# EAGLE design trackduino nano (EAGLE 7.1.0)
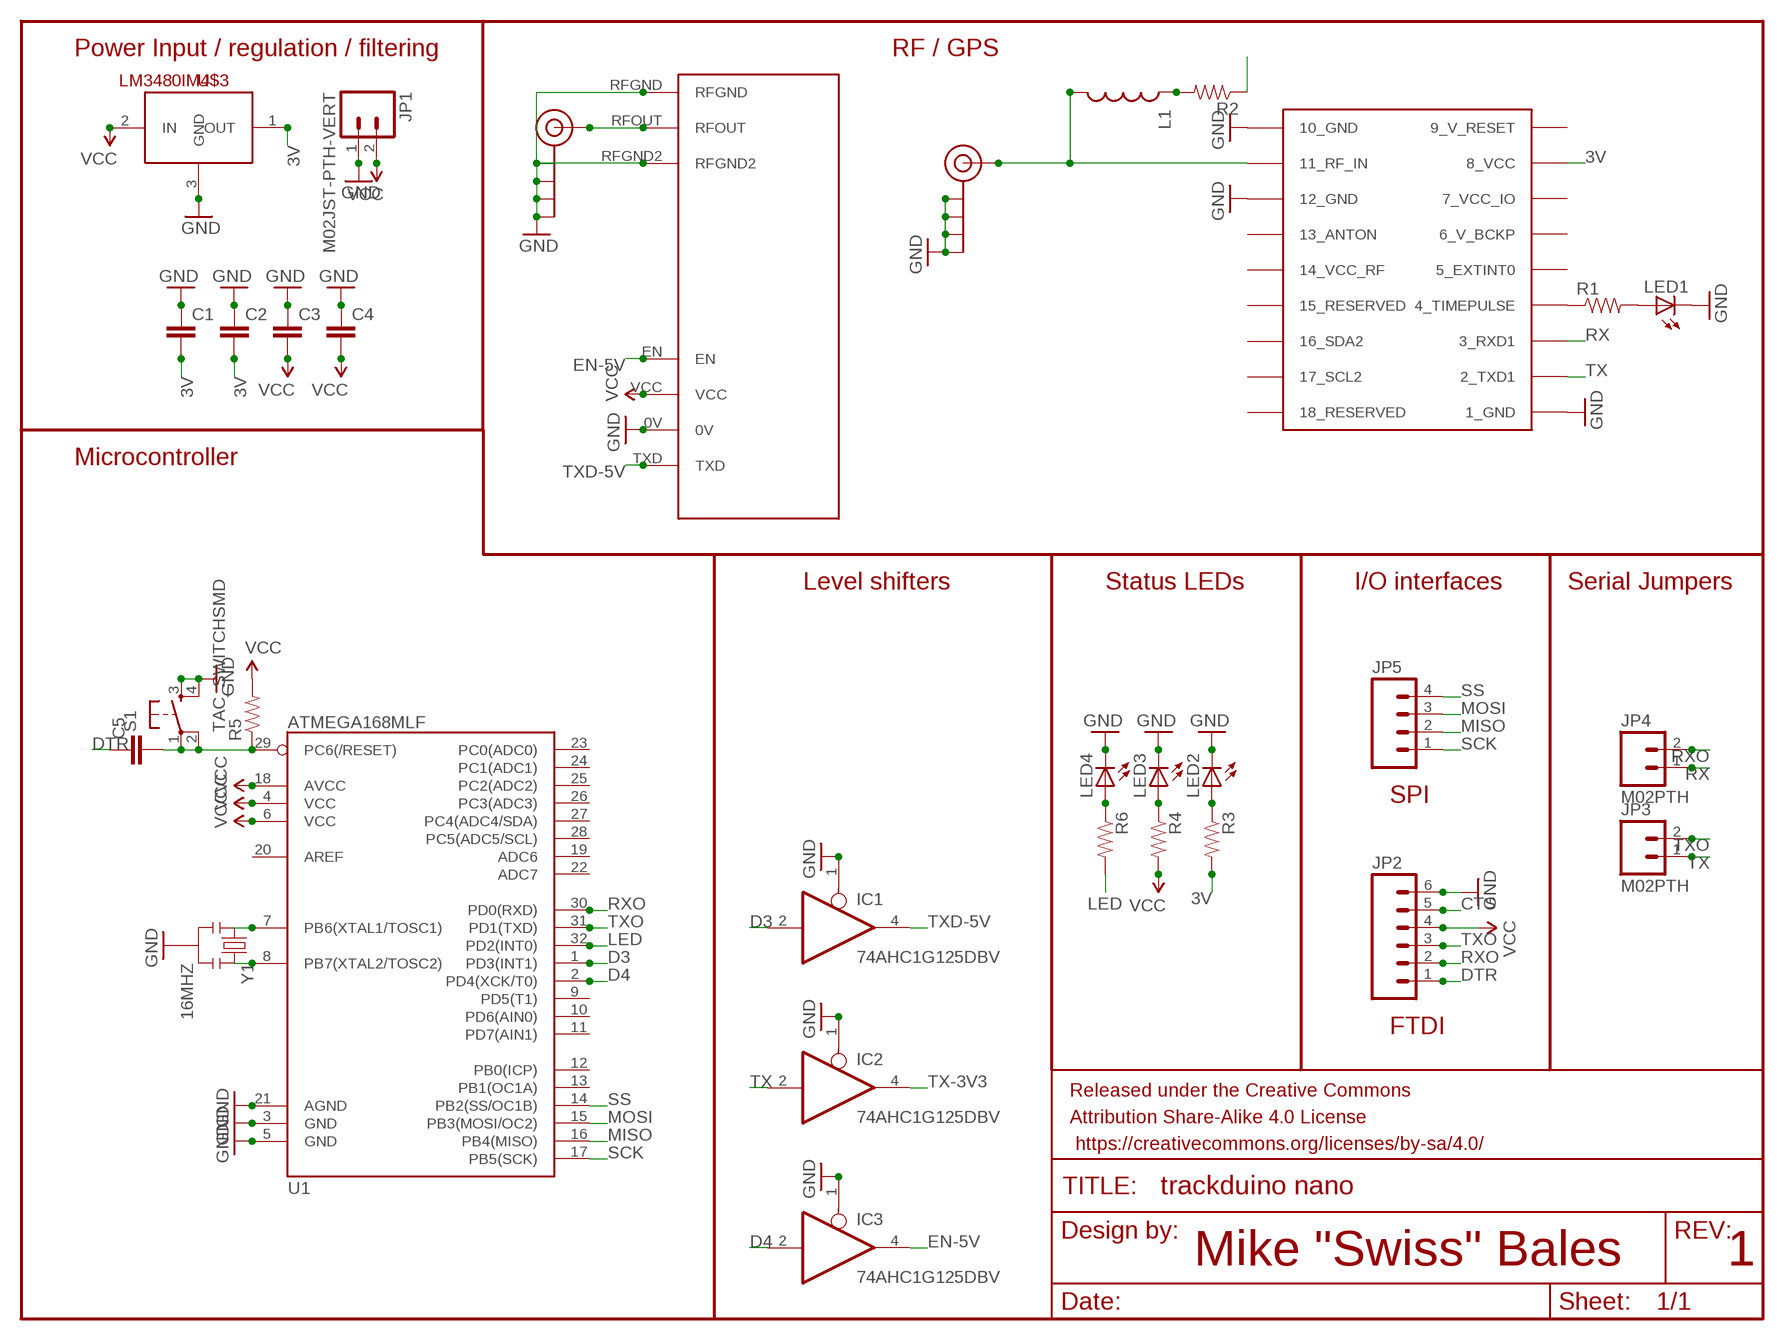
[diagram p0: schematic, sheet 1]

## Parts
C1  CAP0805  [0805]
C2  CAP0805  [0805]
C3  CAP0805  [0805]
C4  CAP0805  [0805]
C5  CAP0805  [0805]
FRAME1  FRAME-LETTER  [CREATIVE_COMMONS]
IC1  74AHC1G125DBV  [SOT23-5]
IC2  74AHC1G125DBV  [SOT23-5]
IC3  74AHC1G125DBV  [SOT23-5]
J$1  SMA_EDGE  [SMA-EDGE]
J$2  SMA_EDGE  [SMA-EDGE]
JP1  M02JST-PTH-VERT  [JST-2-PTH-VERT]
JP2  M06NO_SILK_FEMALE_PTH  [1X06_NO_SILK]
JP3  M02PTH  [1X02]
JP4  M02PTH  [1X02]
JP5  M041X04_NO_SILK  [1X04_NO_SILK]
L1  INDUCTOR0805  [0805]
LED1  LEDCHIP-LED0805  [CHIP-LED0805]
LED2  LEDCHIP-LED0805  [CHIP-LED0805]
LED3  LEDCHIP-LED0805  [CHIP-LED0805]
LED4  LEDCHIP-LED0805  [CHIP-LED0805]
R1  RESISTOR0805-RES  [0805]
R2  RESISTOR0805-RES  [0805]
R3  RESISTOR0805-RES  [0805]
R4  RESISTOR0805-RES  [0805]
R5  RESISTOR0805-RES  [0805]
R6  RESISTOR0805-RES  [0805]
S1  TAC_SWITCHSMD  [TACTILE-SWITCH-SMD]
U1  ATMEGA168MLF  [MLF32]
U$1  UBLOX_MAX  [UBLOX_MAX]
U$2  RADIOMETRIX-HX1  [RADIOMETRIX-HX1]
U$3  LM3480IM4  [SOT23-3]
Y1  16MHZ  RESONATOR16MHZ  [RESONATOR-SMD]

## Nets
3V: C1.2 C2.2 R3.2 U$1.8_VCC U$3.1(OUT)
CTS: JP2.5
D3: IC1.2(I) U1.1(PD3(INT1))
D4: IC3.2(I) U1.2(PD4(XCK/T0))
DTR: C5.1 JP2.1
EN-5V: IC3.4(O) U$2.EN
GND: C1.1 C2.1 C3.1 C4.1 IC1.1(OE) IC2.1(OE) IC3.1(OE) J$1.GND@0(GND) J$1.GND@1(GND) J$1.GND@2(GND) J$1.GND@3(GND) J$2.GND@0(GND) J$2.GND@1(GND) J$2.GND@2(GND) J$2.GND@3(GND) JP1.1 JP2.6 LED1.C LED2.C LED3.C LED4.C S1.3 S1.4 U1.3(GND) U1.5(GND) U1.21(AGND) U$1.1_GND U$1.10_GND U$1.12_GND U$2.0V U$2.RFGND U$2.RFGND2 U$3.3(GND) Y1.2
LED: R6.2 U1.32(PD2(INT0))
MISO: JP5.2 U1.16(PB4(MISO))
MOSI: JP5.3 U1.15(PB3(MOSI/OC2))
N$1: J$1.SIG(SIGNAL) U$2.RFOUT
N$2: R1.1 U$1.4_TIMEPULSE
N$3: LED1.A R1.2
N$4: R2.1
N$5: L1.1 R2.2
N$6: J$2.SIG(SIGNAL) L1.2 U$1.11_RF_IN
N$7: LED2.A R3.1
N$8: LED3.A R4.1
N$9: C5.2 R5.1 S1.1 S1.2 U1.29(PC6(/RESET))
N$14: U1.8(PB7(XTAL2/TOSC2)) Y1.3
N$26: U1.7(PB6(XTAL1/TOSC1)) Y1.1
N$27: LED4.A R6.1
RX: JP4.1 U$1.3_RXD1
RXO: JP2.2 JP4.2 U1.30(PD0(RXD))
SCK: JP5.1 U1.17(PB5(SCK))
SS: JP5.4 U1.14(PB2(SS/OC1B))
TX: IC2.2(I) JP3.1 U$1.2_TXD1
TX-3V3: IC2.4(O)
TXD-5V: IC1.4(O) U$2.TXD
TXO: JP2.3 JP3.2 U1.31(PD1(TXD))
VCC: C3.2 C4.2 JP1.2 JP2.4 R4.2 R5.2 U1.4(VCC) U1.6(VCC) U1.18(AVCC) U$2.VCC U$3.2(IN)
Unconnected: U1.9(PD5(T1)) U1.10(PD6(AIN0)) U1.11(PD7(AIN1)) U1.12(PB0(ICP)) U1.13(PB1(OC1A)) U1.19(ADC6) U1.20(AREF) U1.22(ADC7) U1.23(PC0(ADC0)) U1.24(PC1(ADC1)) U1.25(PC2(ADC2)) U1.26(PC3(ADC3)) U1.27(PC4(ADC4/SDA)) U1.28(PC5(ADC5/SCL)) U$1.5_EXTINT0 U$1.6_V_BCKP U$1.13_ANTON U$1.14_VCC_RF U$1.15_RESERVED U$1.16_SDA2 U$1.17_SCL2 U$1.18_RESERVED

## Notes on the sheet
- Power Input / regulation / filtering | RF / GPS
- Microcontroller
- Level shifters | Status LEDs | I/O interfaces | Serial Jumpers
- SPI
- FTDI
- Mike "Swiss" Bales | 1

## Power pins joined to a net without a drawn wire
7_VCC_IO: U$1.7_VCC_IO
9_V_RESET: U$1.9_V_RESET
GND: IC1.3(GND) IC2.3(GND) IC3.3(GND)
VCC: IC1.5(VCC) IC2.5(VCC) IC3.5(VCC)

## Library data of the parts
C1-C5 = SparkFun-Capacitors:CAP: Capacitor Standard 0603 ceramic capacitor, and 0.1" leaded capacitor.
FRAME1 = SparkFun-Aesthetics:FRAME-LETTER: Schematic Frame Standard 8.5x11 US Letter frame
IC1-IC3 = 74xx-little-us:74*1G125: Single Bus Buffer Gate with 3-State Output
J$1 J$2 = SparkFun-Connectors:SMA_EDGE: SMA Antenna Connector End launch SMA connector. The paste layer has been removed so that the connector can be hand soldered onto the board after reflow.
JP1 JP3 JP4 = SparkFun-Connectors:M02: Standard 2-pin 0.1" header. Use with - straight break away headers ( PRT-00116) - right angle break away headers (PRT-00553) - swiss pins (PRT-00743) - machine pins (PRT-00117) - female headers (PRT-00115) Molex polarized connector foot print use with: PRT-08233 with associated crimp pins and housings. 2.54_SCREWTERM for use with PRT-10571. 3.5mm Screw Terminal footprints for PRT-08084 5mm Screw Terminal footprints for use with PRT-08432
JP2 = SparkFun-Connectors:M06: Header 6 Standard 6-pin 0.1" header. Use with straight break away headers (SKU : PRT-00116), right angle break away headers (PRT-00553), swiss pins (PRT-00743), machine pins (PRT-00117), and female headers (PRT-00115). Molex polarized connector foot print use with SKU : PRT-08094 with associated crimp pins and housings. NOTES ON THE VARIANTS LOCK and LOCK_LONGPADS... This footprint was designed to help hold the alignment of a through-hole component (i.e. 6-pin header) while soldering it into place. You may notice that each hole has been shifted either up or down by 0.005 of an inch from it's more standard position (which is a perfectly straight line). This slight alteration caused the pins (the squares in the middle) to touch the edges of the holes. Because they are alternating, it causes a "brace" to hold the component in place. 0.005 has proven to be the perfect amount of "off-center" position when using our standard breakaway headers. Although looks a little odd when you look at the bare footprint, once you have a header in there, the alteration is very hard to notice. Also,if you push a header all the way into place, it is covered up entirely on the bottom side. This idea of altering the position of holes to aid alignment will be further integrated into the Sparkfun Library for other footprints. It can help hold any component with 3 or more connection pins.; PROD_ID: CONN-08437
JP5 = SparkFun-Connectors:M04: Header 4 Standard 4-pin 0.1" header. Use with straight break away headers (SKU : PRT-00116), right angle break away headers (PRT-00553), swiss pins (PRT-00743), machine pins (PRT-00117), and female headers (PRT-00115). Molex polarized connector foot print use with SKU : PRT-08231 with associated crimp pins and housings. 1MM SMD Version SKU: PRT-10208
L1 = SparkFun-Passives:INDUCTOR: Inductors Basic Inductor/Choke - 0603 and 1206. Footprints are not proven and vary greatly between part numbers. SRN6045- 33uH, 20% 1.4A SDR0403-560KL - 56uH, 10%, 500mA RMS/740mA peak
LED1-LED4 = adafruit:LED: LED OSRAM: - CHIPLED LG R971, LG N971, LY N971, LG Q971, LY Q971, LO R971, LY R971 LH N974, LH R974 LS Q976, LO Q976, LY Q976 LO Q996 - Hyper CHIPLED LW Q18S LB Q993, LB Q99A, LB R99A - SideLED LS A670, LO A670, LY A670, LG A670, LP A670 LB A673, LV A673, LT A673, LW A673 LH A674 LY A675 LS A676, LA A676, LO A676, LY A676, LW A676 LS A679, LY A679, LG A679 - Hyper Micro SIDELED® LS Y876, LA Y876, LO Y876, LY Y876 LT Y87S - SmartLED LW L88C, LW L88S LB L89C, LB L89S, LG L890 LS L89K, LO L89K, LY L89K LS L896, LA L896, LO L896, LY L896 - TOPLED LS T670, LO T670, LY T670, LG T670, LP T670 LSG T670, LSP T670, LSY T670, LOP T670, LYG T670 LG T671, LOG T671, LSG T671 LB T673, LV T673, LT T673, LW T673 LH T674 LS T676, LA T676, LO T676, LY T676, LB T676, LH T676, LSB T676, LW T676 LB T67C, LV T67C, LT T67C, LS T67K, LO T67K, LY T67K, LW E67C LS E67B, LA E67B, LO E67B, LY E67B, LB E67C, LV E67C, LT E67C LW T67C LS T679, LY T679, LG T679 LS T770, LO T770, LY T770, LG T770, LP T770 LB T773, LV T773, LT T773, LW T773 LH T774 LS E675, LA E675, LY E675, LS T675 LS T776, LA T776, LO T776, LY T776, LB T776 LHGB T686 LT T68C, LB T68C - Hyper Mini TOPLED® LB M676 - Mini TOPLED Santana® LG M470 LS M47K, LO M47K, LY M47K Source: http://www.osram.convergy.de/
R1-R6 = SparkFun-Resistors:RESISTOR: Resistor Basic schematic elements and footprints for 0603, 1206, and PTH resistors.
S1 = SparkFun-Electromechanical:TAC_SWITCH: Momentary Switch Button commonly used for reset or general input. Spark Fun Electronics SKU : COM-00097 SMT- SWCH-08247; PROD_ID: SWCH-08247
U1 = SparkFun-DigitalIC:ATMEGA168: Atmel 32-pin 8-bit micro, 16k flash.
U$1 = Ava:UBLOX_MAX: UBLOX MAX
U$2 = Ava:RADIOMETRIX-HX1
U$3 = SparkFun-PowerIC:LM3480IM4: Small package linear regulator
Y1 = SparkFun-FreqCtrl:RESONATOR: Resonator Small SMD resonator. Used, eg, on the Arduino Pro/ Pro Mini boards. 8MHz- XTAL-08895 16MHz- XTAL-08900; PROD_ID: XTAL-08900

## Board
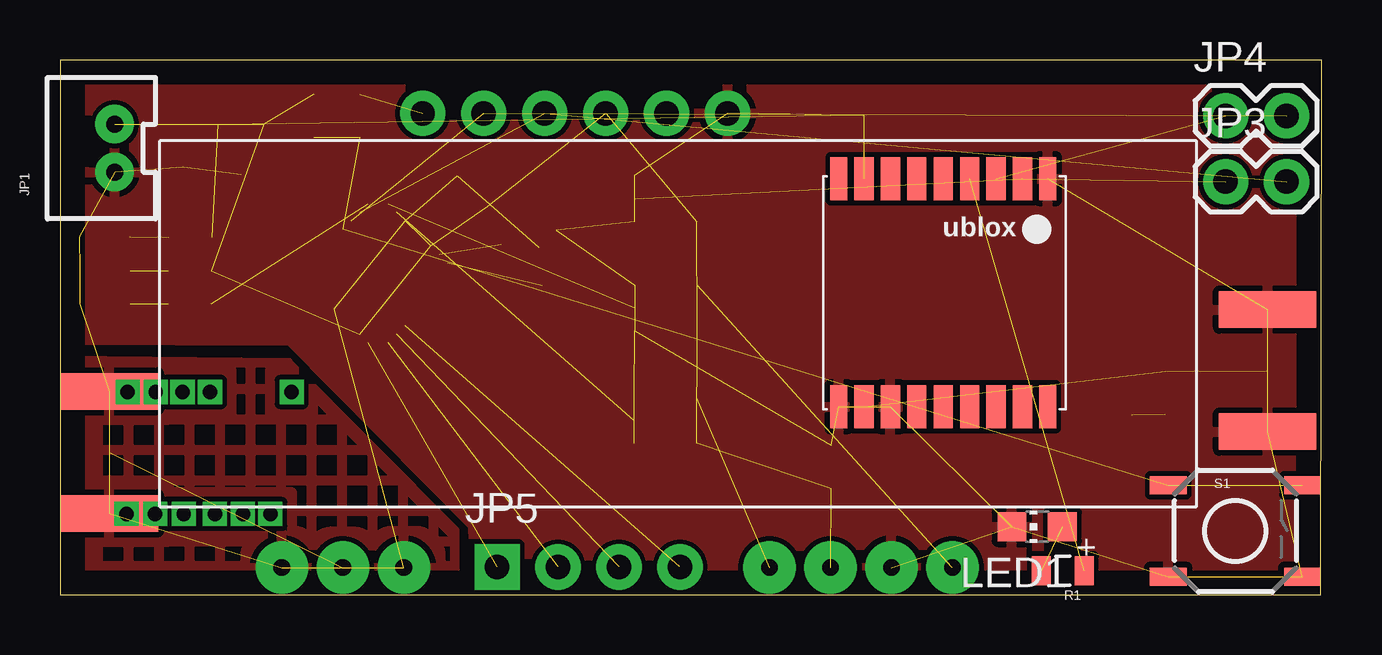
[diagram p1: board, top side]
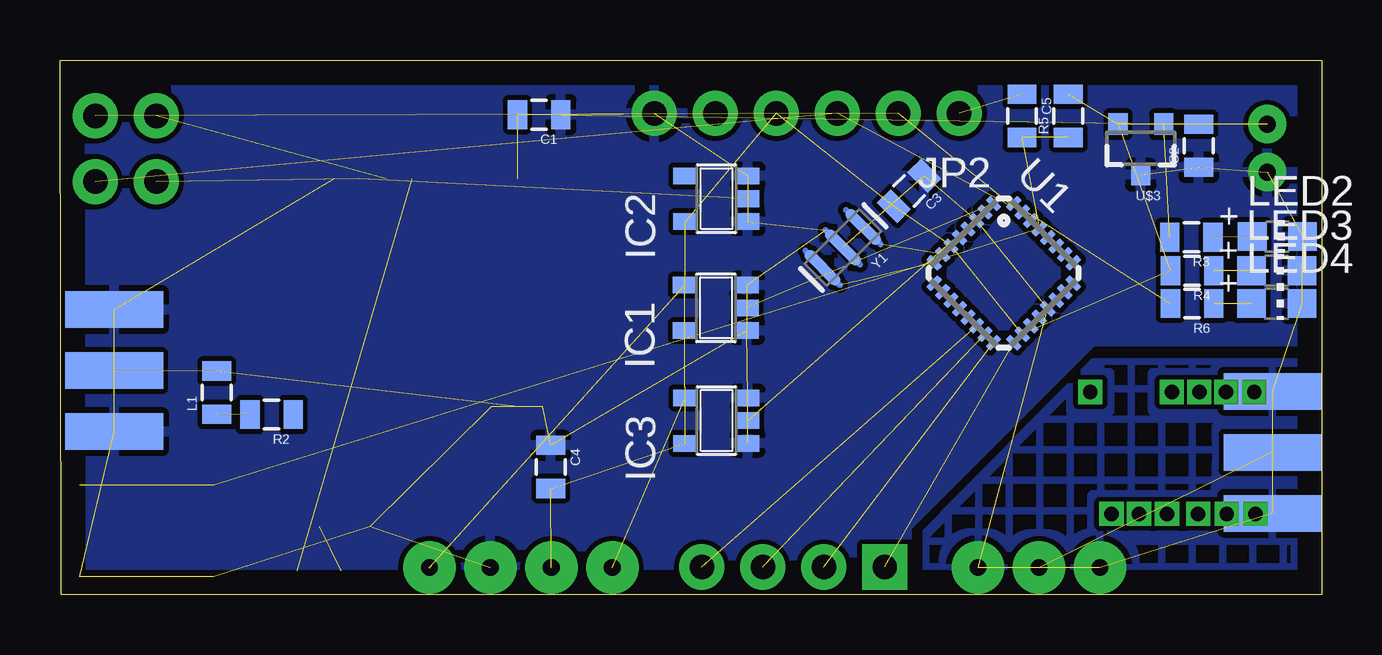
[diagram p2: board, bottom side, seen from below]

Size 52.58 x 22.29 mm. Coordinates in mm from the lower left corner, seen from the top.
Outline: 0,0 52.53,0 52.58,22.29 0,22.29 0,0
Copper layers (1*16): Top 0.035mm / dielectric 1.5mm / Bottom 0.035mm
Design rules "default": minimum track width 10mil, minimum drill 24mil, track to track 8mil, track to pad 8mil, pad to pad 8mil, via to via 8mil, smd to smd 8mil, copper to edge 40mil, drill to drill 8mil, minimum pad ring 10mil, minimum via ring 8mil, stop-mask expansion 4mil, vias tented up to drill 0mil, thermal gap 10mil

### Footprints (pad centres in the part's own frame; a part is rotated, then mirrored left to right if it is on the bottom)
0805 = smd 0.8 x 1.2: 1 -0.9,0; 2 0.9,0
SOT23-5 = smd 0.69 x 0.99: 1 -0.95,-1.29; 2 0,-1.29; 3 0.95,-1.29; 4 0.95,1.3; 5 -0.95,1.3
SMA-EDGE = smd 1.524 x 4.064: GND@0 0,0; GND@1 5.08,0; SIG 2.54,0 | smd 1.524 x 4.064 bottom: GND@2 0,0; GND@3 5.08,0
JST-2-PTH-VERT = drill 0.7 pad 1.6: 1 -1,-0.55; 2 1,-0.55
1X06_NO_SILK = drill 1.016 pad 1.88: 1 0,0; 2 2.54,0; 3 5.08,0; 4 7.62,0; 5 10.16,0; 6 12.7,0
1X02 = drill 1.016 pad 1.88: 1 0,0; 2 2.54,0
1X04_NO_SILK = drill 1.016 pad 1.88 square: 1 0,0 | drill 1.016 pad 1.88: 2 2.54,0; 3 5.08,0; 4 7.62,0
CHIP-LED0805 = smd 1.2 x 1.2: A 0,-1.05; C 0,1.05
TACTILE-SWITCH-SMD = smd 1.524 x 0.762: 1 -2.794,1.905; 2 2.794,1.905; 3 -2.794,-1.905; 4 2.794,-1.905
MLF32 = smd 0.7 x 0.3: 1 -2.35,1.75; 2 -2.35,1.25; 3 -2.35,0.75; 4 -2.35,0.25; 5 -2.35,-0.25; 6 -2.35,-0.75; 7 -2.35,-1.25; 8 -2.35,-1.75; 17 2.35,-1.75; 18 2.35,-1.25; 19 2.35,-0.75; 20 2.35,-0.25; 21 2.35,0.25; 22 2.35,0.75; 23 2.35,1.25; 24 2.35,1.75 | smd 0.3 x 0.7: 9 -1.75,-2.35; 10 -1.25,-2.35; 11 -0.75,-2.35; 12 -0.25,-2.35; 13 0.25,-2.35; 14 0.75,-2.35; 15 1.25,-2.35; 16 1.75,-2.35; 25 1.75,2.35; 26 1.25,2.35; 27 0.75,2.35; 28 0.25,2.35; 29 -0.25,2.35; 30 -0.75,2.35; 31 -1.25,2.35; 32 -1.75,2.35
UBLOX_MAX = smd 1.8 x 0.7: 1_GND 4.95,-4.4; 9_V_RESET 4.95,4.3; 10_GND -4.55,4.3; 18_RESERVED -4.55,-4.4 | smd 1.8 x 0.8: 2_TXD1 4.95,-3.35; 3_RXD1 4.95,-2.25; 4_TIMEPULSE 4.95,-1.15; 5_EXTINT0 4.95,-0.05; 6_V_BCKP 4.95,1.05; 7_VCC_IO 4.95,2.15; 8_VCC 4.95,3.25; 11_RF_IN -4.55,3.25; 12_GND -4.55,2.15; 13_ANTON -4.55,1.05; 14_VCC_RF -4.55,-0.05; 15_RESERVED -4.55,-1.15; 16_SDA2 -4.55,-2.25; 17_SCL2 -4.55,-3.35
RADIOMETRIX-HX1 = drill 0.7 pad 2.184: 0V 8.89,-10.16; EN 3.81,-10.16; RFGND -11.43,-10.16; RFGND2 -16.51,-10.16; RFOUT -13.97,-10.16; TXD 11.43,-10.16; VCC 6.35,-10.16
SOT23-3 = smd 0.8 x 0.9: 1 -0.95,-1; 2 0.95,-1; 3 0,1.1
RESONATOR-SMD = smd 0.45 x 1.905: 1 -1.2,0; 2 0,0; 3 1.2,0

### Placement (x,y rotation side)
C1  32.61,20.02 180 bottom
C2  5.13,18.72 90 bottom
C3  17.2,16.84 225 bottom
C4  32.13,5.33 270 bottom
C5  12.5,19.96 270 bottom
FRAME1  19.1,-8.1 0 top  (outside the outline)
IC1  25.25,11.96 90 bottom
IC2  25.22,16.51 90 bottom
IC3  25.22,7.26 90 bottom
J$1  2.06,3.4 90 bottom
J$2  50.32,6.81 90 bottom
JP1  1.73,18.62 90 top
JP2  15.11,20.07 180 bottom
JP3  48.56,17.22 0 top
JP4  48.56,19.96 0 top
JP5  18.21,1.17 0 top
L1  46.05,8.43 90 bottom
LED1  40.72,2.84 90 top
LED2  1.85,14.94 270 bottom
LED3  1.88,13.51 270 bottom
LED4  1.88,12.14 270 bottom
R1  41.78,1.02 180 top
R2  43.76,7.52 180 bottom
R3  5.44,14.91 180 bottom
R4  5.41,13.51 180 bottom
R5  10.57,19.96 90 bottom
R6  5.41,12.14 180 bottom
S1  48.97,2.67 0 top
U1  13.26,13.41 315 bottom
U$1  36.75,12.4 90 top
U$2  25.76,11.3 0 top
U$3  7.54,18.62 180 bottom
Y1  19.95,14.48 225 bottom

### Tracks (layer width: path | path; a pad name or v marks a point on that pad's centre or on a via)
3V  (4 unrouted)
D3  (1 unrouted)
D4  (1 unrouted)
DTR  (1 unrouted)
EN-5V  (1 unrouted)
GND  (36 unrouted)
  pour Top: -0.03,22.61 52.53,22.56 52.53,-0.43 17.32,-0.43 17.22,2.87 9.6,10.57 0,10.62
  pour Bottom: 0,22.56 52.53,22.56 52.53,-0.43 17.42,-0.43 17.27,-0.28 17.27,2.84 9.55,10.57 0.03,10.57
  pour Top (hatched): 0.03,9.78 9.5,9.68 16.43,2.69 16.43,-0.43 0.03,-0.33
  pour Bottom (hatched): 0.05,9.73 9.5,9.73 16.48,2.64 16.48,-0.41 0.05,-0.43
LED  (1 unrouted)
MISO  (1 unrouted)
MOSI  (1 unrouted)
N$1  (1 unrouted)
N$2  (1 unrouted)
N$3  (1 unrouted)
N$5  (1 unrouted)
N$6  (2 unrouted)
N$7  (1 unrouted)
N$8  (1 unrouted)
N$9  (4 unrouted)
N$12  (via drill 0.6)
  other vias: 2.82,8.46
N$13  (via drill 0.6)
  other vias: 2.77,3.38
N$14  (1 unrouted)
N$17  (via drill 0.6)
  other vias: 3.96,3.38
N$18  (via drill 0.6)
  other vias: 5.16,3.38
N$19  (via drill 0.6)
  other vias: 6.45,3.38
N$20  (via drill 0.6)
  other vias: 7.62,3.38
N$21  (via drill 0.6)
  other vias: 8.76,3.38
N$22  (via drill 0.6)
  other vias: 3.99,8.46
N$23  (via drill 0.6)
  other vias: 5.11,8.46
N$24  (via drill 0.6)
  other vias: 6.25,8.46
N$25  (via drill 0.6)
  other vias: 9.65,8.46
N$26  (1 unrouted)
N$27  (1 unrouted)
RX  (1 unrouted)
RXO  (2 unrouted)
SCK  (1 unrouted)
SS  (1 unrouted)
TX  (2 unrouted)
TXD-5V  (1 unrouted)
TXO  (2 unrouted)
VCC  (13 unrouted)